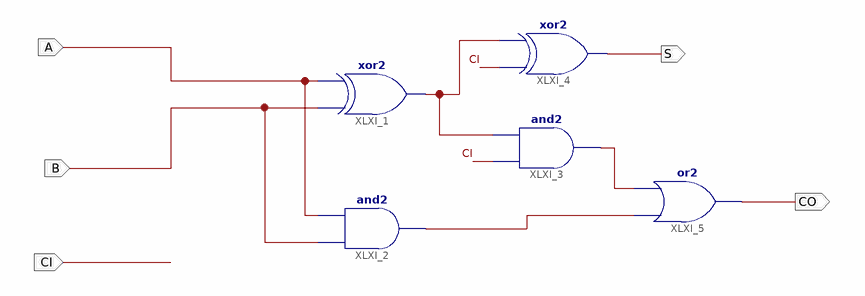
[diagram p0: schematic sheet 1]
// Xilinx ISE schematic FA.sch (spartan6) as structural Verilog: 5 symbols, 5 ports
module FA (
  input  A,
  input  B,
  input  CI,
  output CO,
  output S
);

  wire XLXN_9, XLXN_13, XLXN_14;

  xor XLXI_1 (XLXN_9, B, A);
  and XLXI_2 (XLXN_13, B, A);
  and XLXI_3 (XLXN_14, CI, XLXN_9);
  xor XLXI_4 (S, CI, XLXN_9);
  or XLXI_5 (CO, XLXN_13, XLXN_14);
endmodule
